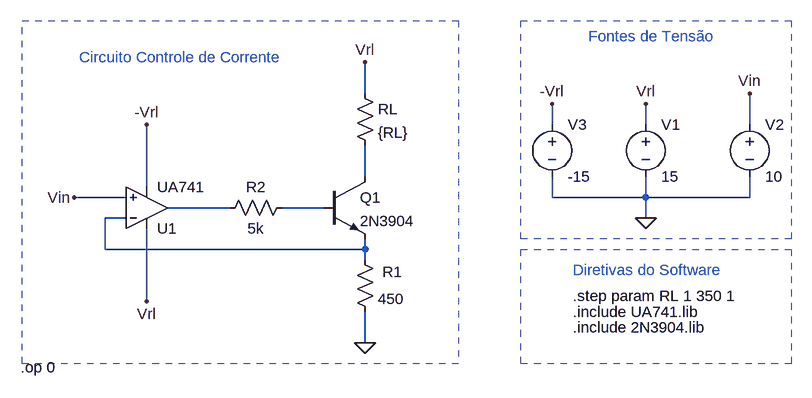
[diagram p0: schematic Trabalho1_Simu_1B.asc]
Trabalho1_Simu_1B.asc, the LTspice schematic file:
Version 4
SHEET 1 880 680
WIRE -480 80 -480 32
WIRE -192 128 -192 96
WIRE -48 128 -48 96
WIRE 112 128 112 80
WIRE -480 208 -480 160
WIRE -816 224 -816 128
WIRE -848 240 -928 240
WIRE -192 240 -192 208
WIRE -48 240 -48 208
WIRE -48 240 -192 240
WIRE 112 240 112 208
WIRE 112 240 -48 240
WIRE -688 256 -784 256
WIRE -544 256 -608 256
WIRE -848 272 -880 272
WIRE -48 272 -48 240
WIRE -880 320 -880 272
WIRE -480 320 -480 304
WIRE -480 320 -880 320
WIRE -480 336 -480 320
WIRE -816 400 -816 288
WIRE -480 464 -480 416
FLAG -480 464 0
FLAG -928 240 Vin
FLAG -480 32 Vrl
FLAG -48 96 Vrl
FLAG 112 80 Vin
FLAG -48 272 0
FLAG -816 400 Vrl
FLAG -192 96 -Vrl
FLAG -816 128 -Vrl
SYMBOL res -496 320 R0
WINDOW 0 43 35 Left 2
SYMATTR InstName R1
SYMATTR Value 450
SYMBOL res -592 240 R90
WINDOW 0 0 56 VBottom 2
WINDOW 3 32 56 VTop 2
SYMATTR InstName R2
SYMATTR Value 5k
SYMBOL res -496 64 R0
SYMATTR InstName RL
SYMATTR Value {RL}
SYMBOL voltage -48 112 R0
WINDOW 123 0 0 Left 0
WINDOW 39 0 0 Left 0
SYMATTR InstName V1
SYMATTR Value 15
SYMBOL voltage 112 112 R0
WINDOW 123 0 0 Left 0
WINDOW 39 0 0 Left 0
SYMATTR InstName V2
SYMATTR Value 10
SYMBOL OpAmps\\opamp2 -816 320 M180
SYMATTR InstName U1
SYMATTR Value UA741
SYMBOL npn -544 208 R0
SYMATTR InstName Q1
SYMATTR Value 2N3904
SYMBOL voltage -192 112 R0
WINDOW 123 0 0 Left 0
WINDOW 39 0 0 Left 0
SYMATTR InstName V3
SYMATTR Value -15
TEXT -160 416 Left 2 !.include UA741.lib
TEXT -920 24 Left 2 ;Circuito Controle de Corrente
TEXT -136 -8 Left 2 ;Fontes de Tensão
TEXT -160 352 Left 2 ;Diretivas do Software
TEXT -160 440 Left 2 !.include 2N3904.lib
TEXT -160 392 Left 2 !.step param RL 1 350 1
TEXT -1010 502 Left 2 !.op 0
RECTANGLE Normal -336 496 -1008 -32 2
RECTANGLE Normal 176 304 -240 -32 2
RECTANGLE Normal 176 496 -240 320 2

The netlist it stands for:
* Trabalho1_Simu_1B.asc
R1 N004 0 450
R2 N003 N002 5k
RL Vrl N001 {RL}
V1 Vrl 0 15
V2 Vin 0 10
XU1 Vin N004 Vrl -Vrl N002 UA741  ; pins In+ In- V+ V- OUT
Q1 N001 N003 N004 0 2N3904
V3 -Vrl 0 -15
.model NPN NPN
.model PNP PNP
.lib standard.bjt
.include UA741.lib
* Circuito Controle de Corrente
* Fontes de Tensão
* Diretivas do Software
.include 2N3904.lib
.step param RL 1 350 1
.op 0
.backanno
.end

* Results of the author's LTspice run, read from the files saved beside the schematic
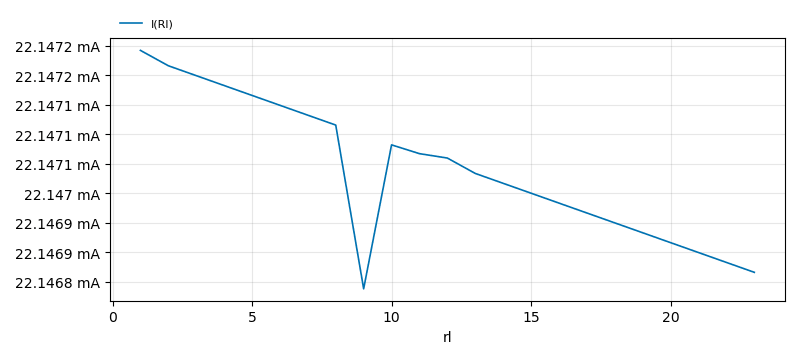
[diagram p1: Operating Point of Trabalho1_Simu_1B.asc, plotted from the saved traces]
* Operating Point, 1 run:
*   I(Rl): 22.15 mA at rl=1 , 22.15 mA at rl=23 , min 22.15 mA, max 22.15 mA
* From the log:
*   Semiconductor Device Operating Points:
*                           --- Diodes ---
*   Name:    d:u1:p      d:u1:ln     d:u1:lp     d:u1:e      d:u1:c
*   Model:    u1:dx       u1:dx       u1:dx       u1:dx       u1:dx
*   Id:     -3.00e-11   -2.51e-11   -2.49e-11   -2.35e-11   -1.29e-12
*   Vd:     -3.00e+01   -2.51e+01   -2.49e+01   -2.35e+01   -1.29e+00
*   Req:     1.00e+12    1.00e+12    1.00e+12    1.00e+12    1.00e+12
*   CAP:     0.00e+00    0.00e+00    0.00e+00    0.00e+00    0.00e+00
*                           --- Bipolar Transistors ---
*   Name:       q1        q:u1:2      q:u1:1
*   Model:    2n3904       u1:qx       u1:qx
*   Ib:       7.46e-05    8.42e-08    8.37e-08
*   Ic:       2.21e-02    5.26e-06    5.23e-06
*   Vbe:      7.39e-01    5.85e-01    5.85e-01
*   Vbc:     -4.24e+00   -4.96e+00   -4.96e+00
*   Vce:      4.98e+00    5.54e+00    5.54e+00
*   BetaDC:   2.97e+02    6.25e+01    6.25e+01
*   Gm:       8.15e-01    2.03e-04    2.02e-04
*   Rpi:      3.47e+02    3.07e+05    3.09e+05
*   Rx:       2.00e+01    0.00e+00    0.00e+00
*   Ro:       4.71e+03    5.79e+96    5.89e+96
*   Cbe:      2.99e-10    0.00e+00    0.00e+00
*   Cbc:      2.14e-12    0.00e+00    0.00e+00
*   Cjs:      0.00e+00    0.00e+00    0.00e+00
*   BetaAC:   2.83e+02    6.25e+01    6.25e+01
*   Cbx:      0.00e+00    0.00e+00    0.00e+00
*   Ft:       4.31e+08    0.00e+00    0.00e+00